# EAGLE schematic DistributedVisionSchematicPage1_33 (EAGLE 9.6.2)
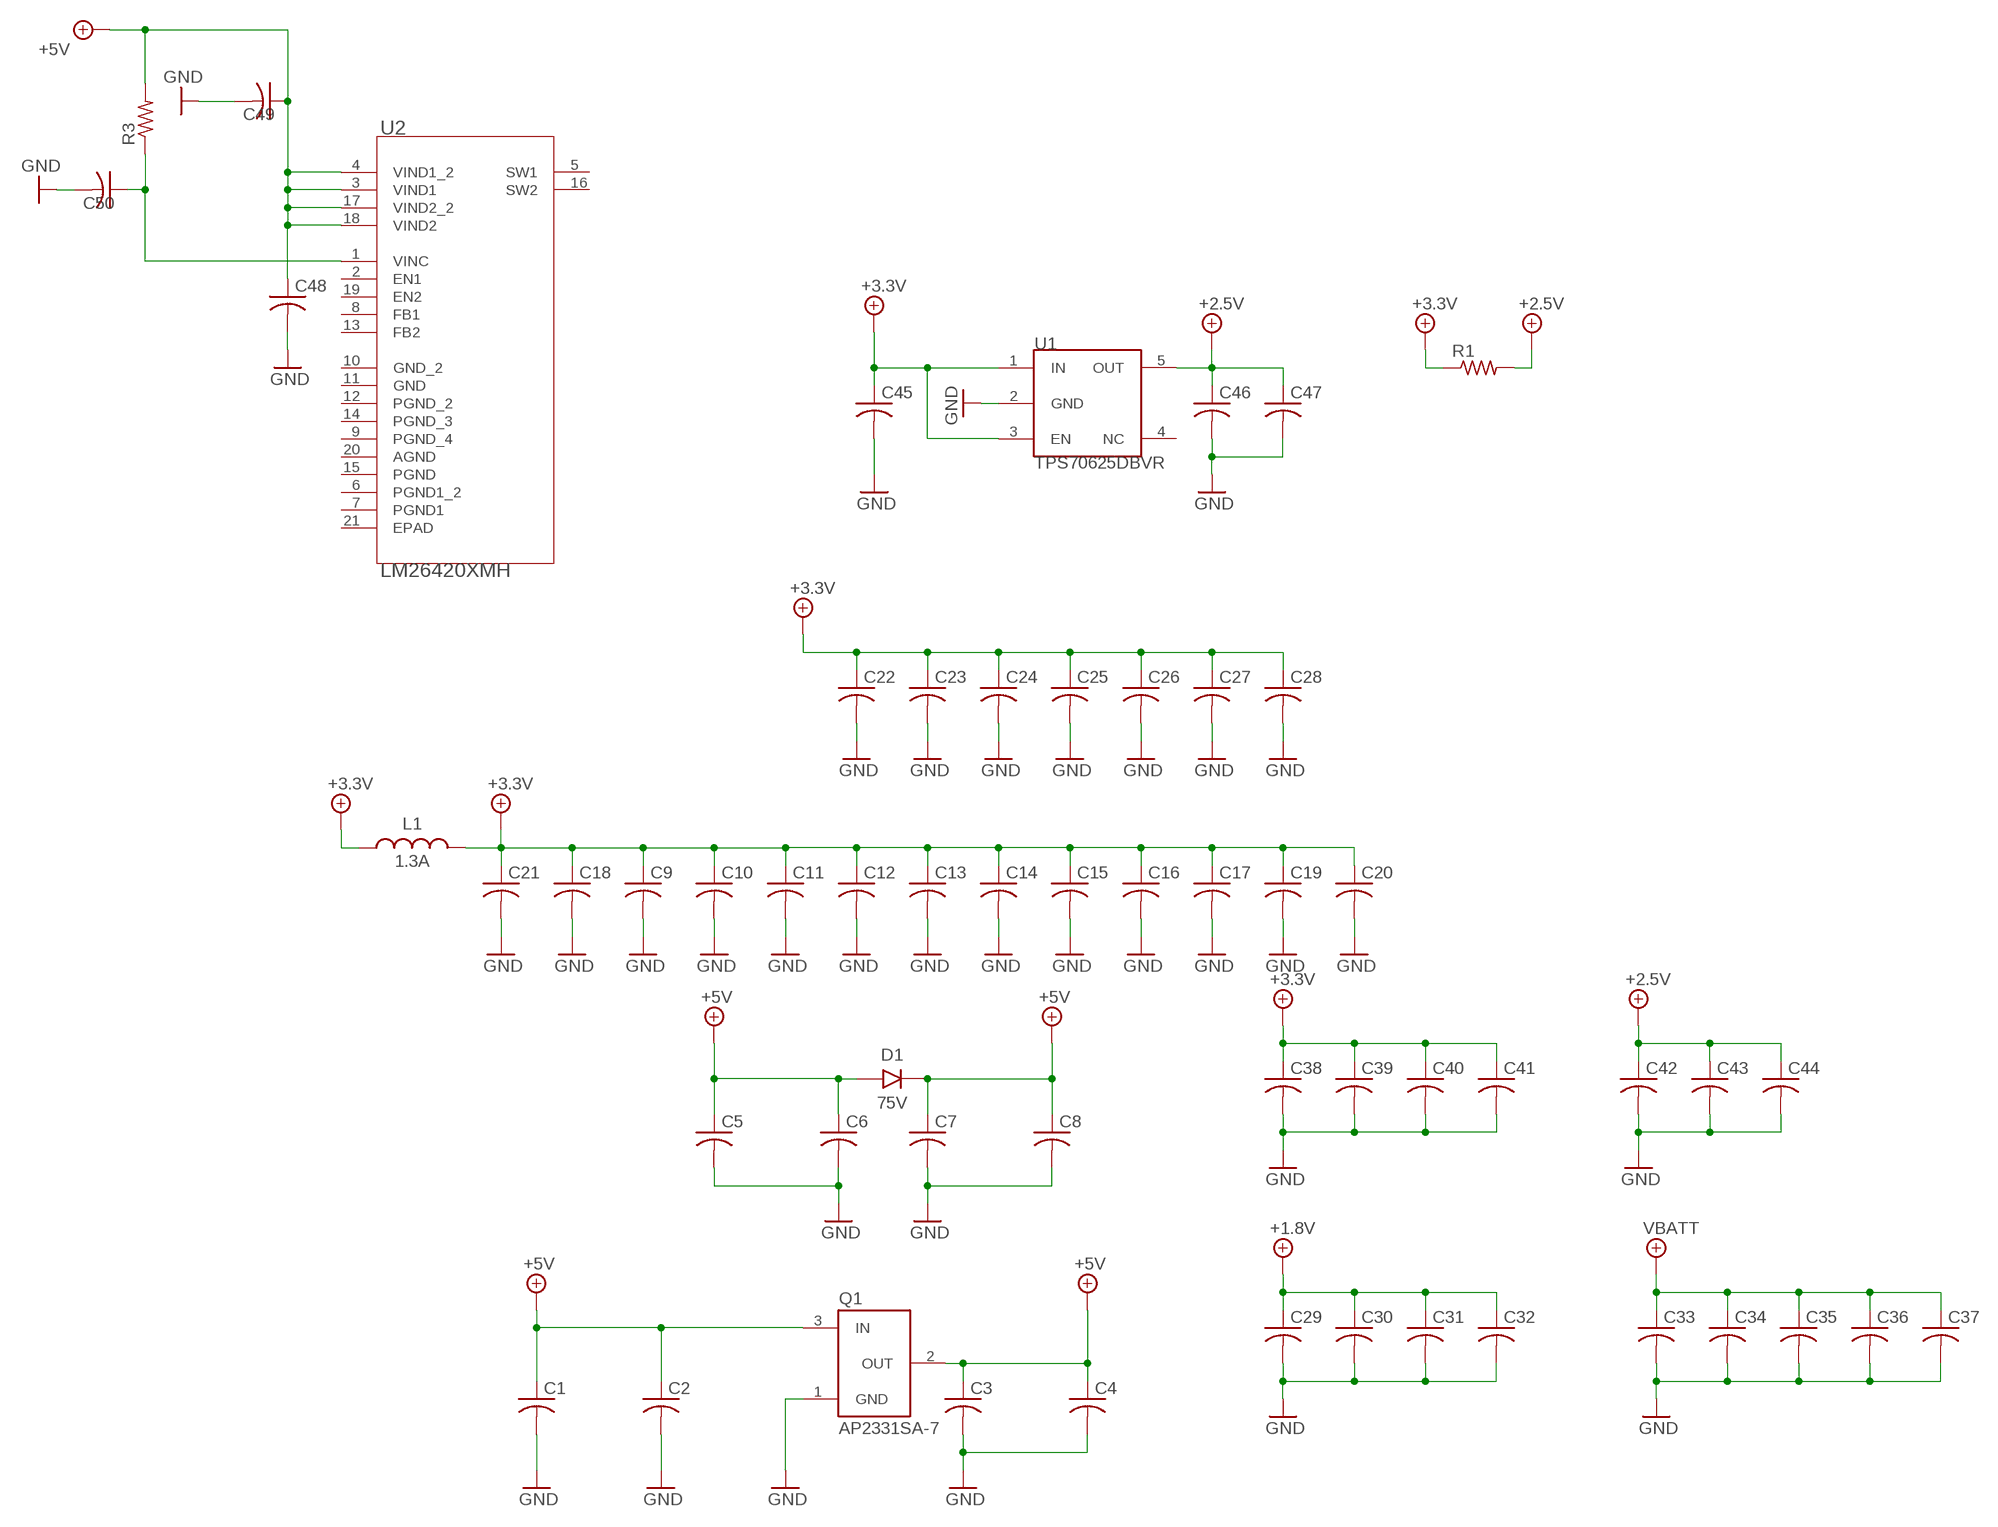
[diagram p0: schematic, sheet 1]

## Parts
C1  C-USC0603  [C0603]
C2  C-USC0603  [C0603]
C3  C-USC0603  [C0603]
C4  C-USC0603  [C0603]
C5  C-USC0603  [C0603]
C6  C-USC0603  [C0603]
C7  C-USC0603  [C0603]
C8  C-USC0603  [C0603]
C9  C-USC0603  [C0603]
C10  C-USC0603  [C0603]
C11  C-USC0603  [C0603]
C12  C-USC0603  [C0603]
C13  C-USC0603  [C0603]
C14  C-USC0603  [C0603]
C15  C-USC0603  [C0603]
C16  C-USC0603  [C0603]
C17  C-USC0603  [C0603]
C18  C-USC0603  [C0603]
C19  C-USC0603  [C0603]
C20  C-USC0603  [C0603]
C21  C-USC0603  [C0603]
C22  C-USC0603  [C0603]
C23  C-USC0603  [C0603]
C24  C-USC0603  [C0603]
C25  C-USC0603  [C0603]
C26  C-USC0603  [C0603]
C27  C-USC0603  [C0603]
C28  C-USC0603  [C0603]
C29  C-USC0603  [C0603]
C30  C-USC0603  [C0603]
C31  C-USC0603  [C0603]
C32  C-USC0603  [C0603]
C33  C-USC0603  [C0603]
C34  C-USC0603  [C0603]
C35  C-USC0603  [C0603]
C36  C-USC0603  [C0603]
C37  C-USC0603  [C0603]
C38  C-USC0603  [C0603]
C39  C-USC0603  [C0603]
C40  C-USC0603  [C0603]
C41  C-USC0603  [C0603]
C42  C-USC0603  [C0603]
C43  C-USC0603  [C0603]
C44  C-USC0603  [C0603]
C45  C-USC0603  [C0603]
C46  C-USC0603  [C0603]
C47  C-USC0603  [C0603]
C48  C-USC0603  [C0603]
C49  C-USC0603  [C0603]
C50  C-USC0603  [C0603]
D1  75V  1N4148WX  [SOD-323]
L1  1.3A  INDUCTOR_0805  [0805]
Q1  AP2331SA-7  [SOT23]
R1  R-US_R0603  [R0603]
R3  R-US_R0603  [R0603]
U1  TPS70625DBVR  [DBV0005A]
U2  LM26420XMH  [PWP0020A]

## Nets
+1.8V: C29.1 C30.1 C31.1 C32.1
+2.5V: C42.1 C43.1 C44.1 C46.1 C47.1 R1.2 U1.5(OUT)
+3.3V: C9.1 C10.1 C11.1 C12.1 C13.1 C14.1 C15.1 C16.1 C17.1 C18.1 C19.1 C20.1 C21.1 C22.1 C23.1 C24.1 C25.1 C26.1 C27.1 C28.1 C38.1 C39.1 C40.1 C41.1 C45.1 L1.1 L1.2 R1.1 U1.1(IN) U1.3(EN)
+5V: C1.1 C2.1 C3.1 C4.1 C5.1 C6.1 C7.1 C8.1 C48.1 C49.1 D1.A D1.C Q1.2(OUT) Q1.3(IN) R3.2 U2.3(VIND1) U2.4(VIND1_2) U2.17(VIND2_2) U2.18(VIND2)
GND: C1.2 C2.2 C3.2 C4.2 C5.2 C6.2 C7.2 C8.2 C9.2 C10.2 C11.2 C12.2 C13.2 C14.2 C15.2 C16.2 C17.2 C18.2 C19.2 C20.2 C21.2 C22.2 C23.2 C24.2 C25.2 C26.2 C27.2 C28.2 C29.2 C30.2 C31.2 C32.2 C33.2 C34.2 C35.2 C36.2 C37.2 C38.2 C39.2 C40.2 C41.2 C42.2 C43.2 C44.2 C45.2 C46.2 C47.2 C48.2 C49.2 C50.2 Q1.1(GND) U1.2(GND)
N$5: C50.1 R3.1 U2.1(VINC)
VBATT: C33.1 C34.1 C35.1 C36.1 C37.1
Unconnected: U1.4(NC) U2.2(EN1) U2.5(SW1) U2.6(PGND1_2) U2.7(PGND1) U2.8(FB1) U2.9(PGND_4) U2.10(GND_2) U2.11(GND) U2.12(PGND_2) U2.13(FB2) U2.14(PGND_3) U2.15(PGND) U2.16(SW2) U2.19(EN2) U2.20(AGND) U2.21(EPAD)

## Library data of the parts
C1-C50 = rcl:C-US: CAPACITOR, American symbol; SPICEPREFIX: C
D1 = RoboJackets-Diodes:1N4148WX: General Purpose Diode - 75V 150MA SOD323; DKPN: 1N4148WXTPMSTR-ND
L1 = RoboJackets-Inductors:INDUCTOR_0805: Generic 0805 Inductor
Q1 = distributed-vision:AP2331SA-7: A single channel current-limited load switch; DKPN: AP2331SA-7DICT-ND
R1 R3 = rcl:R-US_: RESISTOR, American symbol; SPICEPREFIX: R
U1 = distributed-vision:TPS70625DBVR: Linear Voltage regulator. Datasheet Link: https://www.ti.com/lit/ds/symlink/tps706.pdf?HQS=TI-null-null-digikeymode-df-pf-null-wwe&ts=1604760689187; DKPN: 296-48769-1-ND
U2 = distributed-vision:LM26420XMH: Frequency Synchronous Step-Down DCDC Regulator. Datasheet link: https://www.ti.com/lit/ds/symlink/lm26420.pdf?ts=1604867907885&ref_url=https%253A%252F%252Fwww.google.com%252F; DKPN: 296-46301-1-ND